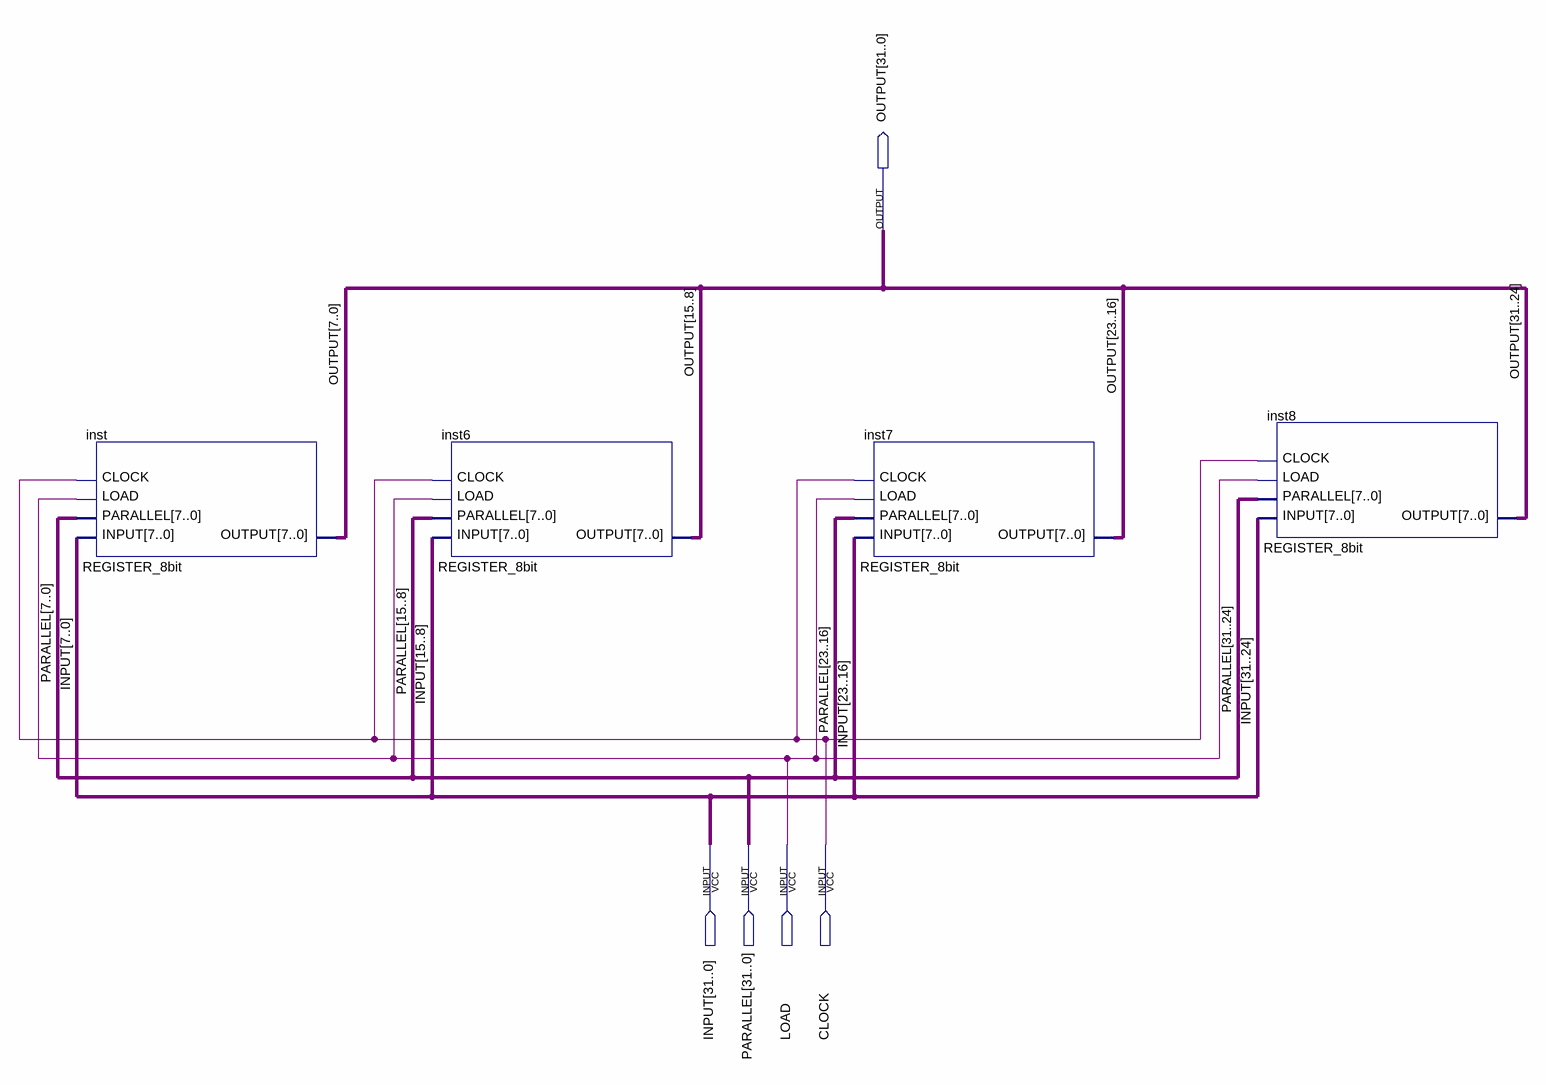
[diagram p0: schematic sheet]
// Quartus schematic REGISTER_32bit.bdf as structural Verilog: 4 symbols, 5 pins
module REGISTER_32bit (
  input  [31:0] INPUT,
  input  [31:0] PARALLEL,
  input  LOAD,
  input  CLOCK,
  output [31:0] OUTPUT
);

  REGISTER_8bit inst (.INPUT(INPUT[7:0]), .PARALLEL(PARALLEL[7:0]), .LOAD(LOAD), .CLOCK(CLOCK), .OUTPUT(OUTPUT[7:0]));
  REGISTER_8bit inst6 (
    .INPUT(INPUT[15:8]), .PARALLEL(PARALLEL[15:8]), .LOAD(LOAD), .CLOCK(CLOCK), .OUTPUT(OUTPUT[15:8]));
  REGISTER_8bit inst7 (
    .INPUT(INPUT[23:16]), .PARALLEL(PARALLEL[23:16]), .LOAD(LOAD), .CLOCK(CLOCK), .OUTPUT(OUTPUT[23:16]));
  REGISTER_8bit inst8 (
    .INPUT(INPUT[31:24]), .PARALLEL(PARALLEL[31:24]), .LOAD(LOAD), .CLOCK(CLOCK), .OUTPUT(OUTPUT[31:24]));
endmodule
